# EAGLE design amf (EAGLE 5.11)
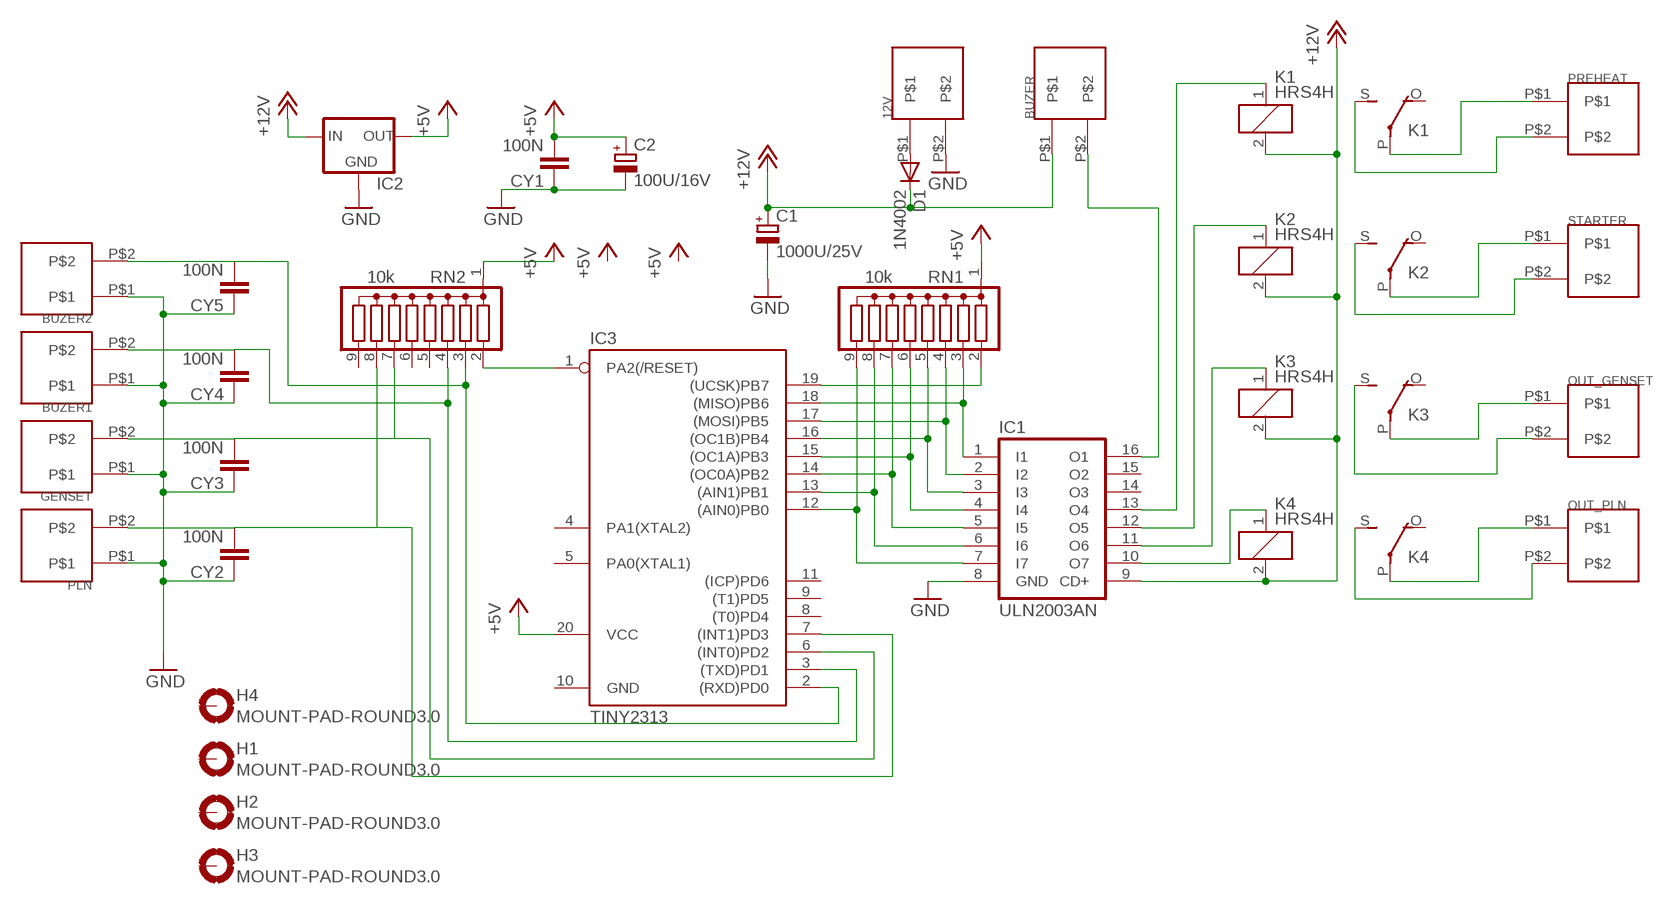
[diagram p0: schematic, sheet 1]

## Parts
12V  TERMINAL-2U-5MM  [TERMINAL-2U-5MM]
BUZER  TERMINAL-2U-5MM  [TERMINAL-2U-5MM]
BUZER1  TERMINAL-2U-5MM  [TERMINAL-2U-5MM]
BUZER2  TERMINAL-2U-5MM  [TERMINAL-2U-5MM]
C1  1000U/25V  CPOL-EUE5-10.5  [E5-10,5]
C2  100U/16V  CPOL-EUE2.5-5  [E2,5-5]
CY1  100N  CYYC7B5  [YC7B5]
CY2  100N  CYYC7B5  [YC7B5]
CY3  100N  CYYC7B5  [YC7B5]
CY4  100N  CYYC7B5  [YC7B5]
CY5  100N  CYYC7B5  [YC7B5]
D1  1N4002  1N4148DO35-10  [DO35-10]
GENSET  TERMINAL-2U-5MM  [TERMINAL-2U-5MM]
H1  MOUNT-PAD-ROUND3.0  [3,0-PAD]
H2  MOUNT-PAD-ROUND3.0  [3,0-PAD]
H3  MOUNT-PAD-ROUND3.0  [3,0-PAD]
H4  MOUNT-PAD-ROUND3.0  [3,0-PAD]
IC1  ULN2003AN  [DIL16]
IC2  78XXS  [78XXS]
IC3  TINY2313  TINY2313-*P*  [DIL20]
K1  HRS4H  ZF112  [ZF112]
K2  HRS4H  ZF112  [ZF112]
K3  HRS4H  ZF112  [ZF112]
K4  HRS4H  ZF112  [ZF112]
OUT_GENSET  TERMINAL-2U-5MM  [TERMINAL-2U-5MM]
OUT_PLN  TERMINAL-2U-5MM  [TERMINAL-2U-5MM]
PLN  TERMINAL-2U-5MM  [TERMINAL-2U-5MM]
PREHEAT  TERMINAL-2U-5MM  [TERMINAL-2U-5MM]
RN1  10k  G08R  [SIL9]
RN2  10k  G08R  [SIL9]
STARTER  TERMINAL-2U-5MM  [TERMINAL-2U-5MM]

## Nets
+5V: C2.+ CY1.2 IC2.OUT IC3.20(VCC) RN1.1 RN2.1
+12V: BUZER.P$1 C1.+ D1.C IC1.9(CD+) IC2.IN K1.2 K2.2 K3.2 K4.2
GND: 12V.P$2 BUZER1.P$1 BUZER2.P$1 C1.- C2.- CY1.1 CY2.1 CY3.1 CY4.1 CY5.1 GENSET.P$1 IC1.8(GND) IC2.GND PLN.P$1
N$1: 12V.P$1 D1.A
N$2: IC3.19((UCSK)PB7) RN1.2
N$3: IC1.10(O7) K4.1
N$4: IC1.11(O6) K3.1
N$5: IC1.12(O5) K2.1
N$6: IC1.13(O4) K1.1
N$7: IC1.7(I7) IC3.12((AIN0)PB0) RN1.9
N$8: IC1.6(I6) IC3.13((AIN1)PB1) RN1.8
N$9: IC1.5(I5) IC3.14((OC0A)PB2) RN1.7
N$10: IC1.4(I4) IC3.15((OC1A)PB3) RN1.6
N$11: IC1.3(I3) IC3.16((OC1B)PB4) RN1.5
N$12: IC1.2(I2) IC3.17((MOSI)PB5) RN1.4
N$13: IC1.1(I1) IC3.18((MISO)PB6) RN1.3
N$14: K4.P(2:P) OUT_PLN.P$1
N$15: K3.P(2:P) OUT_GENSET.P$1
N$16: K4.S(2:S) OUT_PLN.P$2
N$17: K3.S(2:S) OUT_GENSET.P$2
N$18: K2.P(2:P) STARTER.P$1
N$19: K2.S(2:S) STARTER.P$2
N$20: K1.P(2:P) PREHEAT.P$1
N$21: K1.S(2:S) PREHEAT.P$2
N$22: BUZER1.P$2 CY4.2 IC3.3((TXD)PD1) RN2.4
N$23: BUZER.P$2 IC1.16(O1)
N$26: BUZER2.P$2 CY5.2 IC3.2((RXD)PD0) RN2.3
N$27: IC3.1(PA2(/RESET)) RN2.2
N$28: CY3.2 GENSET.P$2 IC3.6((INT0)PD2) RN2.7
N$29: CY2.2 IC3.7((INT1)PD3) PLN.P$2 RN2.8
Unconnected: H1.B3,0(MOUNT) H2.B3,0(MOUNT) H3.B3,0(MOUNT) H4.B3,0(MOUNT) IC1.14(O3) IC1.15(O2) IC3.4(PA1(XTAL2)) IC3.5(PA0(XTAL1)) IC3.8((T0)PD4) IC3.9((T1)PD5) IC3.11((ICP)PD6) K1.O(2:O) K2.O(2:O) K3.O(2:O) K4.O(2:O) RN2.5 RN2.6 RN2.9

## Power pins joined to a net without a drawn wire
GND: IC3.10(GND)

## Library data of the parts
12V BUZER BUZER1 BUZER2 GENSET OUT_GENSET OUT_PLN PLN PREHEAT STARTER = Itead_BP_110825.lbr:TERMINAL-2U-5MM: CON001
C1 C2 = resistor:CPOL-EU: POLARIZED CAPACITOR, European symbol
CY1-CY5 = resistor:CY: Y CAPACITOR for power line
D1 = diode:1N4148: DIODE high speed (Philips)
H1-H4 = holes:MOUNT-PAD-ROUND: MOUNTING PAD, round
IC1 = uln-udn:ULN2003A: DRIVER ARRAY
IC2 = v-reg:78XXS: VOLTAGE REGULATOR
IC3 = avr-6:TINY2313*: Atmel Tiny2313 2K Flash, 128 bytes EEPROM, 128 bytes RAM
K1-K4 = relay:ZF112: RELAY 1 x switch; OC_FARNELL: unknown; OC_NEWARK: unknown
RN1 RN2 = resistor-sil:G08R: SIL RESISTOR; OC_FARNELL: unknown; OC_NEWARK: unknown

## Board
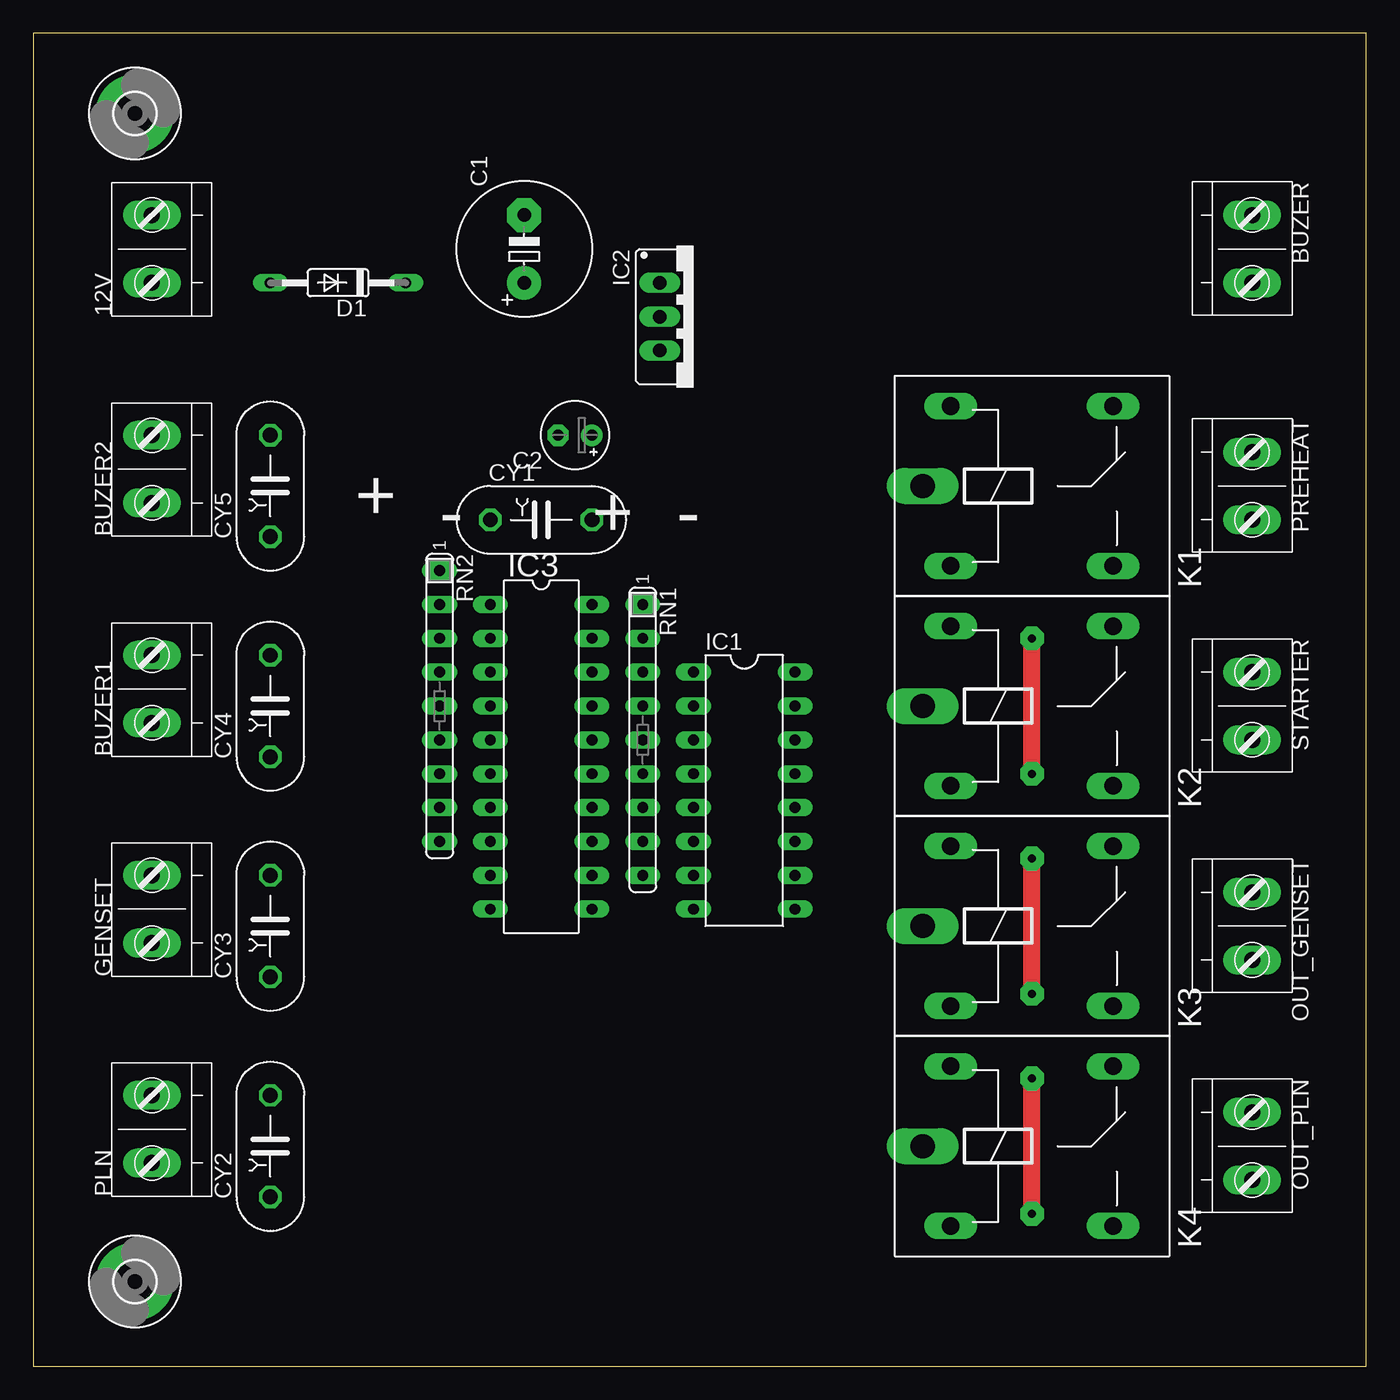
[diagram p1: board, top side]
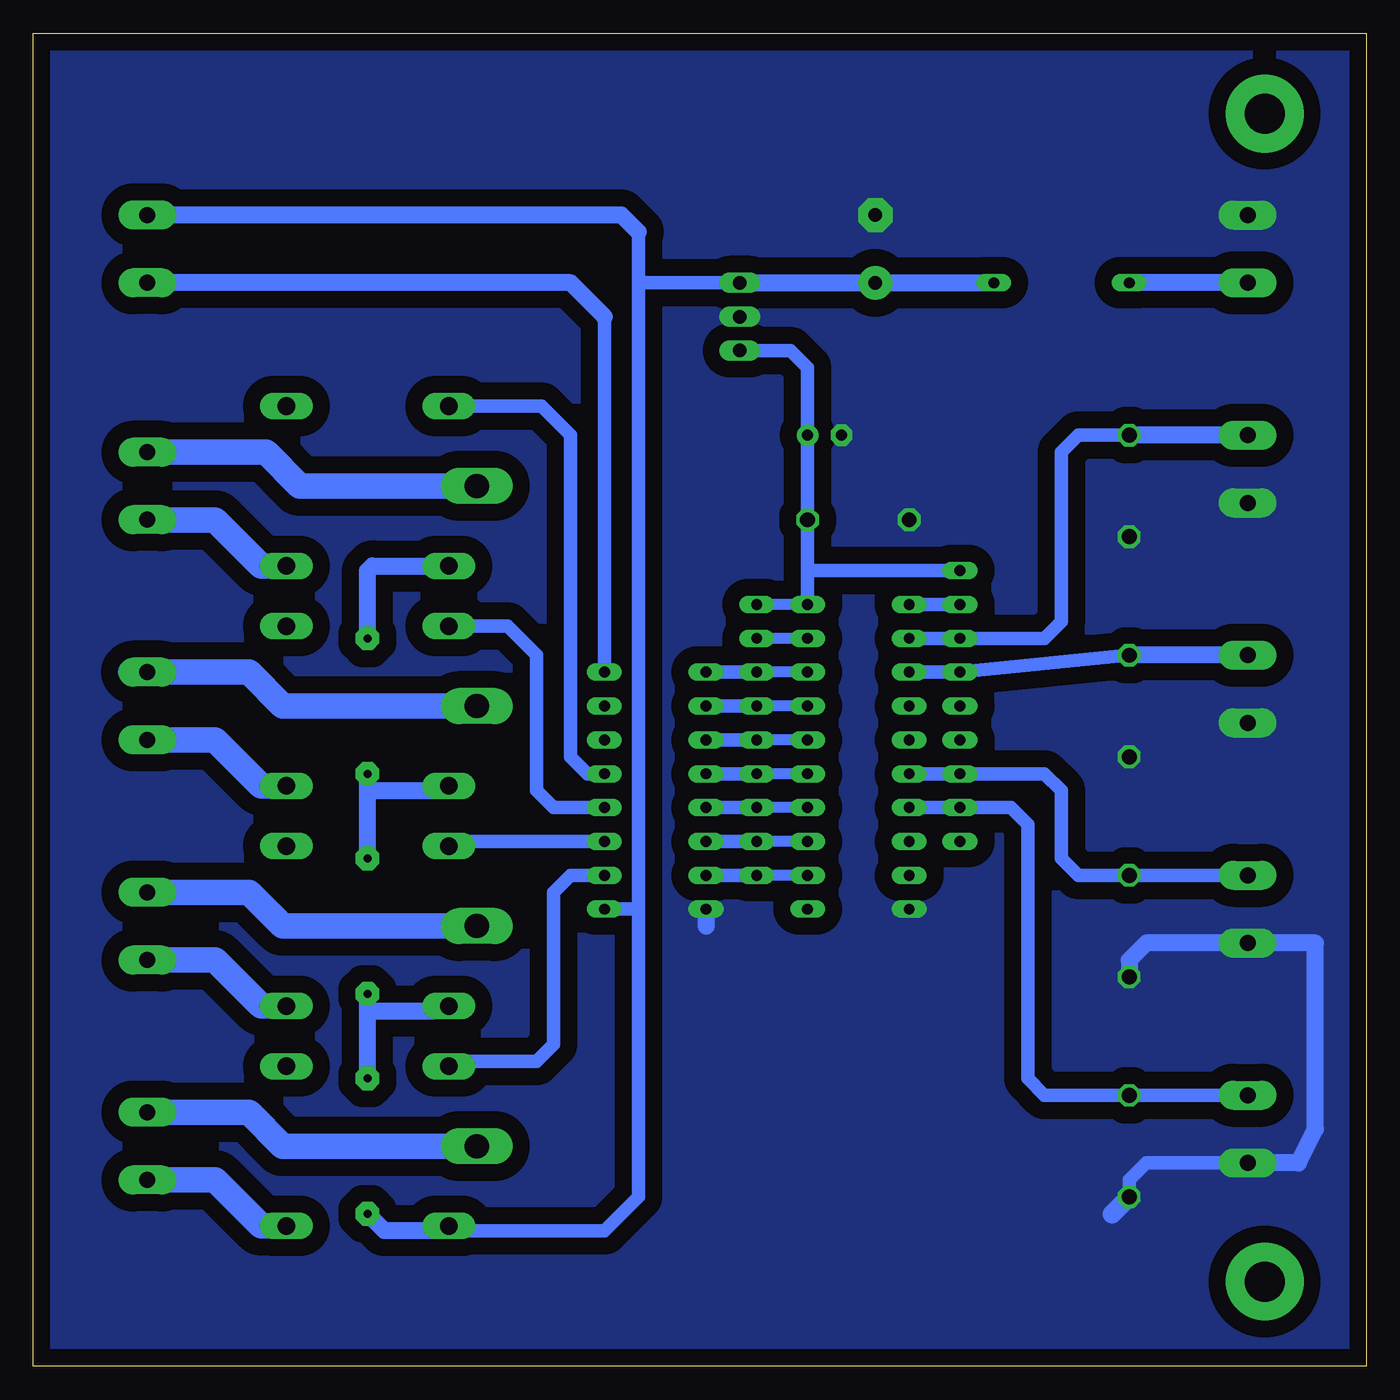
[diagram p2: board, bottom side, seen from below]

Size 100 x 100 mm. Coordinates in mm from the lower left corner, seen from the top.
Outline: 0,0 100,0 100,100 0,100 0,0
Copper layers (1*16): Top 0.035mm / dielectric 1.5mm / Bottom 0.035mm
Design rules "default": minimum track width 10mil, minimum drill 24mil, track to track 8mil, track to pad 8mil, pad to pad 8mil, via to via 8mil, smd to smd 8mil, copper to edge 40mil, drill to drill 8mil, minimum pad ring 10mil, minimum via ring 8mil, stop-mask expansion 4mil, vias tented up to drill 0mil, thermal gap 10mil

### Footprints (pad centres in the part's own frame; a part is rotated, then mirrored left to right if it is on the bottom)
TERMINAL-2U-5MM = drill 1.2 pad 2.184 long: P$1 2.54,5.08; P$2 7.62,5.08
E5-10,5 = drill 1.016 pad 2.54 round: + -2.54,0 | drill 1.016 pad 2.54 octagon: - 2.54,0
E2,5-5 = drill 0.813 pad 1.6 round: + -1.27,0 | drill 0.813 pad 1.6 octagon: - 1.27,0
YC7B5 = drill 1.118 octagon: 1 -3.81,0; 2 3.81,0
DO35-10 = drill 0.813 long: A 5.08,0; C -5.08,0
3,0-PAD = drill 3 pad 5.842 round: B3,0 0,0
DIL16 = drill 0.813 long: 1 -8.89,-3.81; 2 -6.35,-3.81; 3 -3.81,-3.81; 4 -1.27,-3.81; 5 1.27,-3.81; 6 3.81,-3.81; 7 6.35,-3.81; 8 8.89,-3.81; 9 8.89,3.81; 10 6.35,3.81; 11 3.81,3.81; 12 1.27,3.81; 13 -1.27,3.81; 14 -3.81,3.81; 15 -6.35,3.81; 16 -8.89,3.81
78XXS = drill 1.016 long: GND 0,-2.54; IN -2.54,-2.54; OUT 2.54,-2.54
DIL20 = drill 0.813 long: 1 -11.43,-3.81; 2 -8.89,-3.81; 3 -6.35,-3.81; 4 -3.81,-3.81; 5 -1.27,-3.81; 6 1.27,-3.81; 7 3.81,-3.81; 8 6.35,-3.81; 9 8.89,-3.81; 10 11.43,-3.81; 11 11.43,3.81; 12 8.89,3.81; 13 6.35,3.81; 14 3.81,3.81; 15 1.27,3.81; 16 -1.27,3.81; 17 -3.81,3.81; 18 -6.35,3.81; 19 -8.89,3.81; 20 -11.43,3.81
ZF112 = drill 1.321 long: 1 -6.096,5.994; 2 -6.096,-5.994; O 6.096,5.994; S 6.096,-5.994 | drill 1.803 long: P -8.204,0
SIL9 = drill 0.813 long: 1 -10.16,0; 2 -7.62,0; 3 -5.08,0; 4 -2.54,0; 5 0,0; 6 2.54,0; 7 5.08,0; 8 7.62,0; 9 10.16,0

### Placement (x,y rotation side)
12V  13.97,78.74 90 top
BUZER  86.36,88.9 270 top
BUZER1  13.97,45.72 90 top
BUZER2  13.97,62.23 90 top
C1  36.83,83.82 90 top
C2  40.64,69.85 180 top
CY1  38.1,63.5 0 top
CY2  17.78,16.51 90 top
CY3  17.78,33.02 90 top
CY4  17.78,49.53 90 top
CY5  17.78,66.04 90 top
D1  22.86,81.28 180 top
GENSET  13.97,29.21 90 top
H1  7.62,6.35 0 top
H2  7.62,93.98 0 top
H3  -22.86,5.08 0 top  (outside the outline)
H4  -31.75,5.08 0 top  (outside the outline)
IC1  53.34,43.18 270 top
IC2  49.53,78.74 270 top
IC3  38.1,45.72 270 top
K1  74.93,66.04 0 top
K2  74.93,49.53 0 top
K3  74.93,33.02 0 top
K4  74.93,16.51 0 top
OUT_GENSET  86.36,38.1 270 top
OUT_PLN  86.36,21.59 270 top
PLN  13.97,12.7 90 top
PREHEAT  86.36,71.12 270 top
RN1  45.72,46.99 270 top
RN2  30.48,49.53 270 top
STARTER  86.36,54.61 270 top

### Tracks (layer width: path | path; a pad name or v marks a point on that pad's centre or on a via)
+5V
  Bottom 0.813: IC3.20 RN1.1
  Bottom 1.016: RN2.1 41.91,59.69 | 41.91,59.69 IC3.20 | 41.91,59.69 CY1.2 C2.+ 41.91,74.93 43.18,76.2 IC2.OUT
+12V  (via drill 0.6 pad 1.78)
  Top 1.27: v74.93,44.45 v74.93,54.61 | v74.93,27.94 v74.93,38.1 | v74.93,11.43 v74.93,21.59
  Bottom 1.016: K4.2 68.48,10.16 57.15,10.16 54.61,12.7 54.61,34.29 | 54.61,34.29 IC1.9 | 54.61,81.28 IC2.IN | 54.61,34.29 54.61,81.28 | 54.61,81.28 54.61,85.09
  Bottom 1.27: 74.93,43.18 v74.93,44.45 | 74.93,43.18 69.19,43.18 K2.2 | K3.2 69.49,27.03 69.85,26.67 74.93,26.67 | 74.93,26.67 v74.93,27.94 | v74.93,38.1 74.93,43.18 | K4.2 69.49,10.52 69.85,10.16 73.66,10.16 v74.93,11.43 | v74.93,21.59 74.93,26.67 | 68.48,59.69 K1.2 74.57,60.05 74.93,59.69 v74.93,54.61 | BUZER.P$1 55.88,86.36 54.61,85.09 | D1.C C1.+ IC2.IN
GND
  Bottom 1.016: 16.51,31.75 GENSET.P$1 | PLN.P$1 16.51,15.24 17.78,13.97 CY2.1
  Bottom 1.27: CY3.1 17.78,30.48 16.51,31.75 3.81,31.75 3.81,17.78 5.08,15.24 PLN.P$1 | IC1.8 49.53,33.02
  Bottom 1.422: CY2.1 19.05,11.43
  pour Bottom (isolate 1.27, no thermals): 1.27,99.06 100.33,99.06 99.06,0 0,0
N$1
  Bottom 1.27: 12V.P$1 D1.A
N$2
  Bottom 0.813: IC3.19 RN1.2
N$3
  Bottom 1.016: IC1.10 59.69,36.83 60.96,35.56 60.96,24.13 62.23,22.86 68.48,22.86 K4.1
N$4
  Bottom 1.016: IC1.11 68.48,39.37 K3.1
N$5
  Bottom 1.016: K2.1 64.41,55.52 62.23,53.34 62.23,43.18 60.96,41.91 IC1.12
N$6
  Bottom 1.016: K1.1 61.87,72.03 59.69,69.85 59.69,45.72 58.42,44.45 IC1.13
N$7
  Bottom 0.813: IC3.12 RN1.9
  Bottom 1.016: RN1.9 IC1.7
N$8
  Bottom 0.813: IC3.13 RN1.8
  Bottom 1.016: RN1.8 IC1.6
N$9
  Bottom 0.813: IC3.14 RN1.7
  Bottom 1.016: RN1.7 IC1.5
N$10
  Bottom 0.813: IC3.15 RN1.6
  Bottom 1.016: RN1.6 IC1.4
N$11
  Bottom 0.813: IC3.16 RN1.5
  Bottom 1.016: RN1.5 IC1.3
N$12
  Bottom 0.813: IC3.17 RN1.4
  Bottom 1.016: RN1.4 IC1.2
N$13
  Bottom 0.813: IC3.18 RN1.3
  Bottom 1.016: RN1.3 IC1.1
N$14
  Bottom 1.93: K4.P 81.28,16.51 83.82,19.05 OUT_PLN.P$1
N$15
  Bottom 1.93: K3.P 81.28,33.02 83.82,35.56 OUT_GENSET.P$1
N$16
  Bottom 1.93: K4.S 82.91,10.52 86.36,13.97 OUT_PLN.P$2
N$17
  Bottom 1.93: K3.S 82.91,27.03 86.36,30.48 OUT_GENSET.P$2
N$18
  Bottom 1.93: K2.P 81.28,49.53 83.82,52.07 STARTER.P$1 92.71,52.07
N$19
  Bottom 1.93: K2.S 82.91,43.54 86.36,46.99 STARTER.P$2
N$20
  Bottom 1.93: K1.P 80.01,66.04 82.55,68.58 PREHEAT.P$1
N$21
  Bottom 1.93: K1.S 82.91,60.05 86.36,63.5 PREHEAT.P$2
N$22
  Bottom 1.016: IC3.3 RN2.4 CY4.2
  Bottom 1.27: BUZER1.P$2 CY4.2
N$23
  Bottom 1.016: IC1.16 57.15,78.74
  Bottom 1.27: 57.15,78.74 59.69,81.28 BUZER.P$2
N$26
  Bottom 1.016: IC3.2 RN2.3 24.13,54.61 22.86,55.88 22.86,68.58 21.59,69.85 CY5.2
  Bottom 1.27: BUZER2.P$2 CY5.2
N$27
  Bottom 1.016: RN2.2 IC3.1
N$28
  Bottom 1.016: GENSET.P$2 CY3.2 21.59,36.83 22.86,38.1 22.86,43.18 24.13,44.45 RN2.7 IC3.6
N$29
  Bottom 1.016: PLN.P$2 CY2.2 24.13,20.32 25.4,21.59 25.4,40.64 26.67,41.91 RN2.8 IC3.7

### Text on the board
tPlace: + | - | + | -